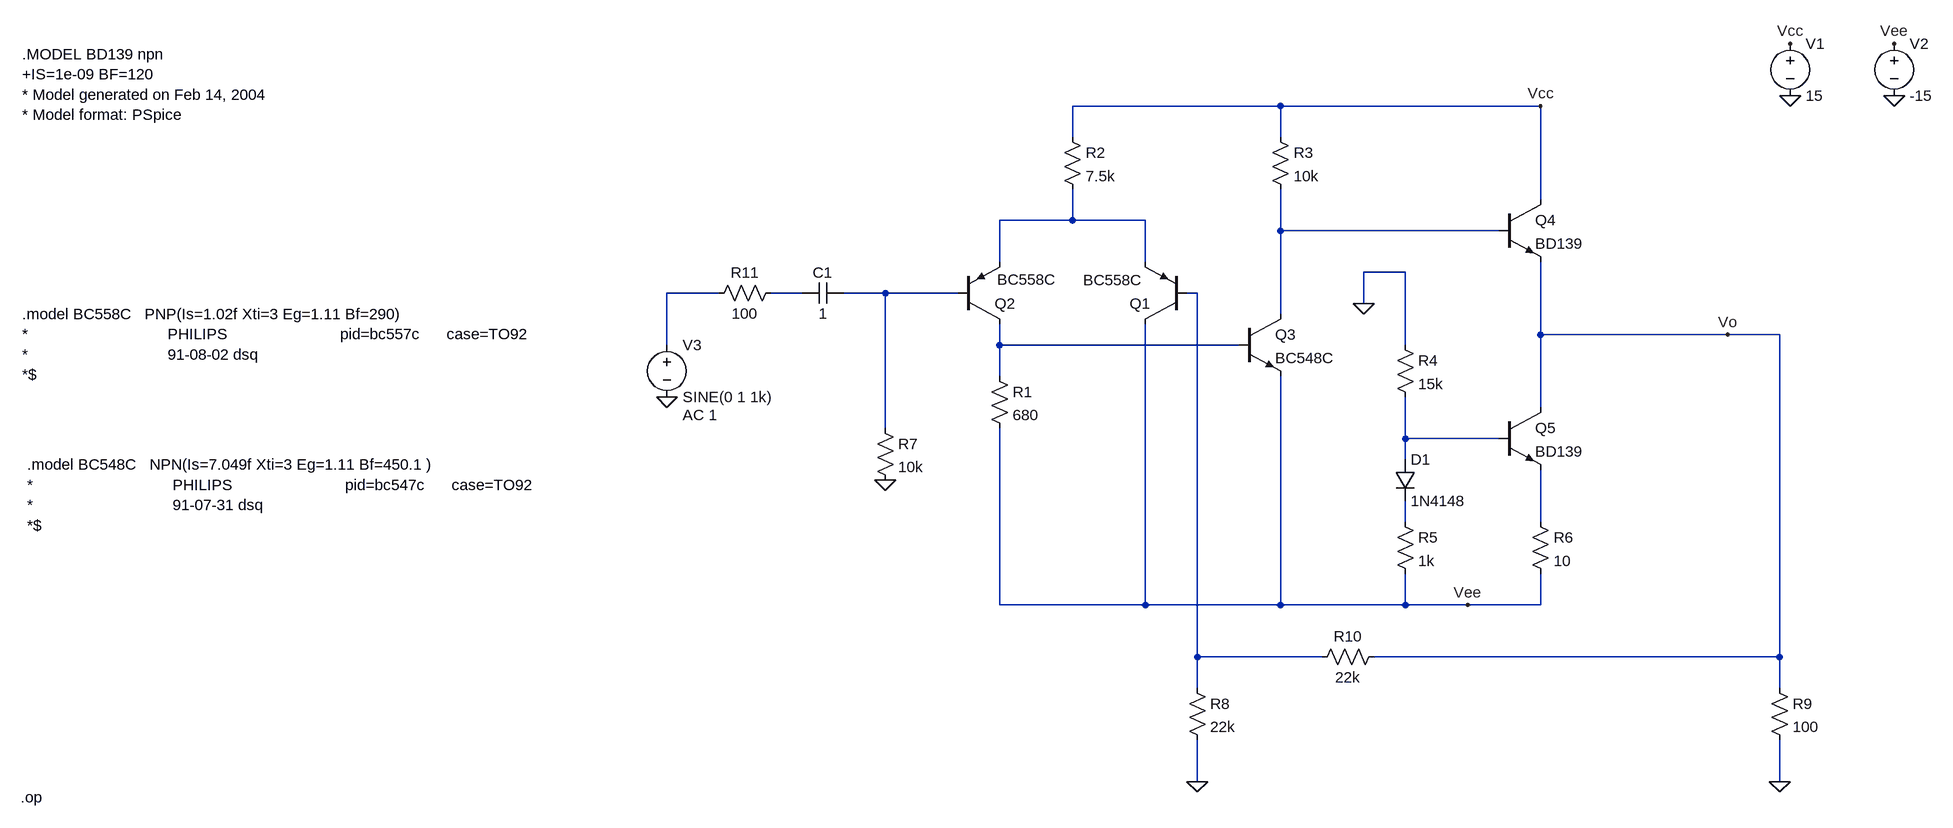
[diagram p0: schematic Ejercicio_1_16_3.asc]
Ejercicio_1_16_3.asc, the LTspice schematic file:
Version 4
SHEET 1 1104 964
WIRE 96 -160 -224 -160
WIRE 496 -160 96 -160
WIRE -224 -112 -224 -160
WIRE 96 -112 96 -160
WIRE 496 -16 496 -160
WIRE -224 16 -224 -32
WIRE -224 16 -336 16
WIRE -112 16 -224 16
WIRE 96 32 96 -32
WIRE 432 32 96 32
WIRE -336 80 -336 16
WIRE -112 80 -112 16
WIRE 288 96 224 96
WIRE -768 128 -848 128
WIRE -640 128 -688 128
WIRE -512 128 -576 128
WIRE -400 128 -512 128
WIRE -32 128 -48 128
WIRE 224 144 224 96
WIRE 96 160 96 32
WIRE 496 192 496 80
WIRE 784 192 496 192
WIRE 864 192 784 192
WIRE -848 208 -848 128
WIRE -336 208 -336 176
WIRE 32 208 -336 208
WIRE 288 208 288 96
WIRE -336 256 -336 208
WIRE 496 304 496 192
WIRE -512 336 -512 128
WIRE 288 352 288 288
WIRE 432 352 288 352
WIRE 288 384 288 352
WIRE 288 480 288 448
WIRE 496 480 496 400
WIRE -336 608 -336 336
WIRE -112 608 -112 176
WIRE -112 608 -336 608
WIRE 96 608 96 256
WIRE 96 608 -112 608
WIRE 288 608 288 560
WIRE 288 608 96 608
WIRE 384 608 288 608
WIRE 496 608 496 560
WIRE 496 608 384 608
WIRE -32 688 -32 128
WIRE 160 688 -32 688
WIRE 864 688 864 192
WIRE 864 688 240 688
WIRE -32 736 -32 688
WIRE 864 736 864 688
WIRE -32 880 -32 816
WIRE 864 880 864 816
FLAG 880 -176 0
FLAG 1040 -176 0
FLAG 880 -256 Vcc
FLAG 1040 -256 Vee
FLAG -32 880 0
FLAG -512 416 0
FLAG 224 144 0
FLAG 496 -160 Vcc
FLAG 384 608 Vee
FLAG 864 880 0
FLAG -848 288 0
FLAG 784 192 Vo
SYMBOL pnp -48 176 R180
WINDOW 3 69 68 Left 2
SYMATTR InstName Q1
SYMATTR Value BC558C
SYMBOL pnp -400 176 M180
WINDOW 3 60 69 Left 2
SYMATTR InstName Q2
SYMATTR Value BC558C
SYMBOL res -352 240 R0
SYMATTR InstName R1
SYMATTR Value 680
SYMBOL res -240 -128 R0
SYMATTR InstName R2
SYMATTR Value 7.5k
SYMBOL npn 32 160 R0
SYMATTR InstName Q3
SYMATTR Value BC548C
SYMBOL npn 432 -16 R0
SYMATTR InstName Q4
SYMATTR Value BD139
SYMBOL npn 432 304 R0
SYMATTR InstName Q5
SYMATTR Value BD139
SYMBOL voltage 880 -272 R0
WINDOW 123 0 0 Left 2
WINDOW 39 0 0 Left 2
SYMATTR InstName V1
SYMATTR Value 15
SYMBOL voltage 1040 -272 R0
WINDOW 123 0 0 Left 2
WINDOW 39 0 0 Left 2
SYMATTR InstName V2
SYMATTR Value -15
SYMBOL res 80 -128 R0
SYMATTR InstName R3
SYMATTR Value 10k
SYMBOL res 272 192 R0
SYMATTR InstName R4
SYMATTR Value 15k
SYMBOL res 272 464 R0
SYMATTR InstName R5
SYMATTR Value 1k
SYMBOL res 480 464 R0
SYMATTR InstName R6
SYMATTR Value 10
SYMBOL res -528 320 R0
SYMATTR InstName R7
SYMATTR Value 10k
SYMBOL res -48 720 R0
SYMATTR InstName R8
SYMATTR Value 22k
SYMBOL diode 272 384 R0
SYMATTR InstName D1
SYMATTR Value 1N4148
SYMBOL res 848 720 R0
SYMATTR InstName R9
SYMATTR Value 100
SYMBOL res 144 704 R270
WINDOW 0 32 56 VTop 2
WINDOW 3 0 56 VBottom 2
SYMATTR InstName R10
SYMATTR Value 22k
SYMBOL voltage -848 192 R0
WINDOW 123 24 124 Left 2
WINDOW 39 0 0 Left 2
SYMATTR InstName V3
SYMATTR Value SINE(0 1 1k)
SYMATTR Value2 AC 1
SYMBOL res -672 112 R90
WINDOW 0 0 56 VBottom 2
WINDOW 3 32 56 VTop 2
SYMATTR InstName R11
SYMATTR Value 100
SYMBOL cap -576 112 R90
WINDOW 0 0 32 VBottom 2
WINDOW 3 32 32 VTop 2
SYMATTR InstName C1
SYMATTR Value 1
TEXT -1840 -240 Left 2 !.MODEL BD139 npn\n+IS=1e-09 BF=120\n* Model generated on Feb 14, 2004\n* Model format: PSpice
TEXT -1840 160 Left 2 !.model BC558C   PNP(Is=1.02f Xti=3 Eg=1.11 Bf=290)\n*                               PHILIPS                         pid=bc557c      case=TO92\n*                               91-08-02 dsq\n*$
TEXT -1832 392 Left 2 !.model BC548C   NPN(Is=7.049f Xti=3 Eg=1.11 Bf=450.1 )\n*                               PHILIPS                         pid=bc547c      case=TO92\n*                               91-07-31 dsq\n*$
TEXT -1842 904 Left 2 !.op

The netlist it stands for:
* Ejercicio_1_16_3.asc
Q1 Vee N006 N001 0 BC558C
Q2 N007 N005 N001 0 BC558C
R1 N007 Vee 680
R2 Vcc N001 7.5k
Q3 N002 N007 Vee 0 BC548C
Q4 Vcc N002 Vo 0 BD139
Q5 Vo N008 N010 0 BD139
V1 Vcc 0 15
V2 Vee 0 -15
R3 Vcc N002 10k
R4 0 N008 15k
R5 N009 Vee 1k
R6 N010 Vee 10
R7 N005 0 10k
R8 N006 0 22k
D1 N008 N009 1N4148
R9 Vo 0 100
R10 N006 Vo 22k
V3 N003 0 SINE(0 1 1k) AC 1
R11 N004 N003 100
C1 N005 N004 1
.model D D
.lib standard.dio
.model NPN NPN
.model PNP PNP
.lib standard.bjt
.MODEL BD139 npn
+IS=1e-09 BF=120
* Model generated on Feb 14, 2004
* Model format: PSpice
.model BC558C   PNP(Is=1.02f Xti=3 Eg=1.11 Bf=290)
*                               PHILIPS                         pid=bc557c      case=TO92
*                               91-08-02 dsq
*$
.model BC548C   NPN(Is=7.049f Xti=3 Eg=1.11 Bf=450.1 )
*                               PHILIPS                         pid=bc547c      case=TO92
*                               91-07-31 dsq
*$
.op
.backanno
.end